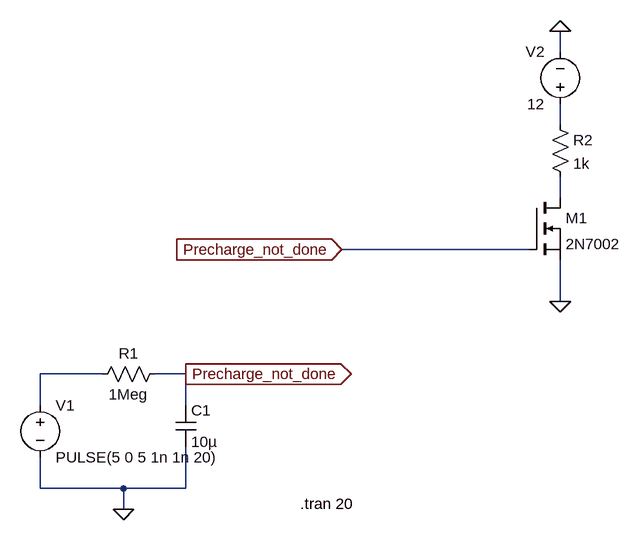
[diagram p0: schematic Precharge_delay.asc]
Precharge_delay.asc, the LTspice schematic file:
Version 4
SHEET 1 1220 680
WIRE 1120 -288 1120 -320
WIRE 1120 -176 1120 -208
WIRE 1120 -64 1120 -96
WIRE 1072 16 784 16
WIRE 1120 96 1120 32
WIRE 416 208 320 208
WIRE 544 208 496 208
WIRE 320 256 320 208
WIRE 544 256 544 208
WIRE 320 384 320 336
WIRE 448 384 320 384
WIRE 544 384 544 320
WIRE 544 384 448 384
WIRE 448 416 448 384
FLAG 448 416 0
FLAG 544 208 Precharge_not_done
IOPIN 544 208 Out
FLAG 784 16 Precharge_not_done
IOPIN 784 16 In
FLAG 1120 96 0
FLAG 1120 -320 0
SYMBOL voltage 320 240 R0
SYMATTR InstName V1
SYMATTR Value PULSE(5 0 5 1n 1n 20)
SYMBOL Res 512 192 R90
WINDOW 0 0 56 VBottom 2
WINDOW 3 32 56 VTop 2
SYMATTR InstName R1
SYMATTR Value 1Meg
SYMBOL Cap 528 256 R0
SYMATTR InstName C1
SYMATTR Value 10µ
SYMBOL nmos 1072 -64 R0
SYMATTR InstName M1
SYMATTR Value 2N7002
SYMBOL Voltage 1120 -192 R180
WINDOW 0 24 96 Left 2
WINDOW 3 24 16 Left 2
SYMATTR InstName V2
SYMATTR Value 12
SYMBOL Res 1104 -192 R0
SYMATTR InstName R2
SYMATTR Value 1k
TEXT 720 408 Left 2 !.tran 20

The netlist it stands for:
* Precharge_delay.asc
V1 N003 0 PULSE(5 0 5 1n 1n 20)
R1 Precharge_not_done N003 1Meg
C1 Precharge_not_done 0 10µ
M1 N002 Precharge_not_done 0 0 2N7002
V2 N001 0 12
R2 N001 N002 1k
.model NMOS NMOS
.model PMOS PMOS
.lib standard.mos
.tran 20
.backanno
.end